# EAGLE design Codeshelf-0011.v01.r01 (EAGLE 5.11)
MFGN: Murata; MFGP: GRM155R71C104JA88D; PRICE: 0.03
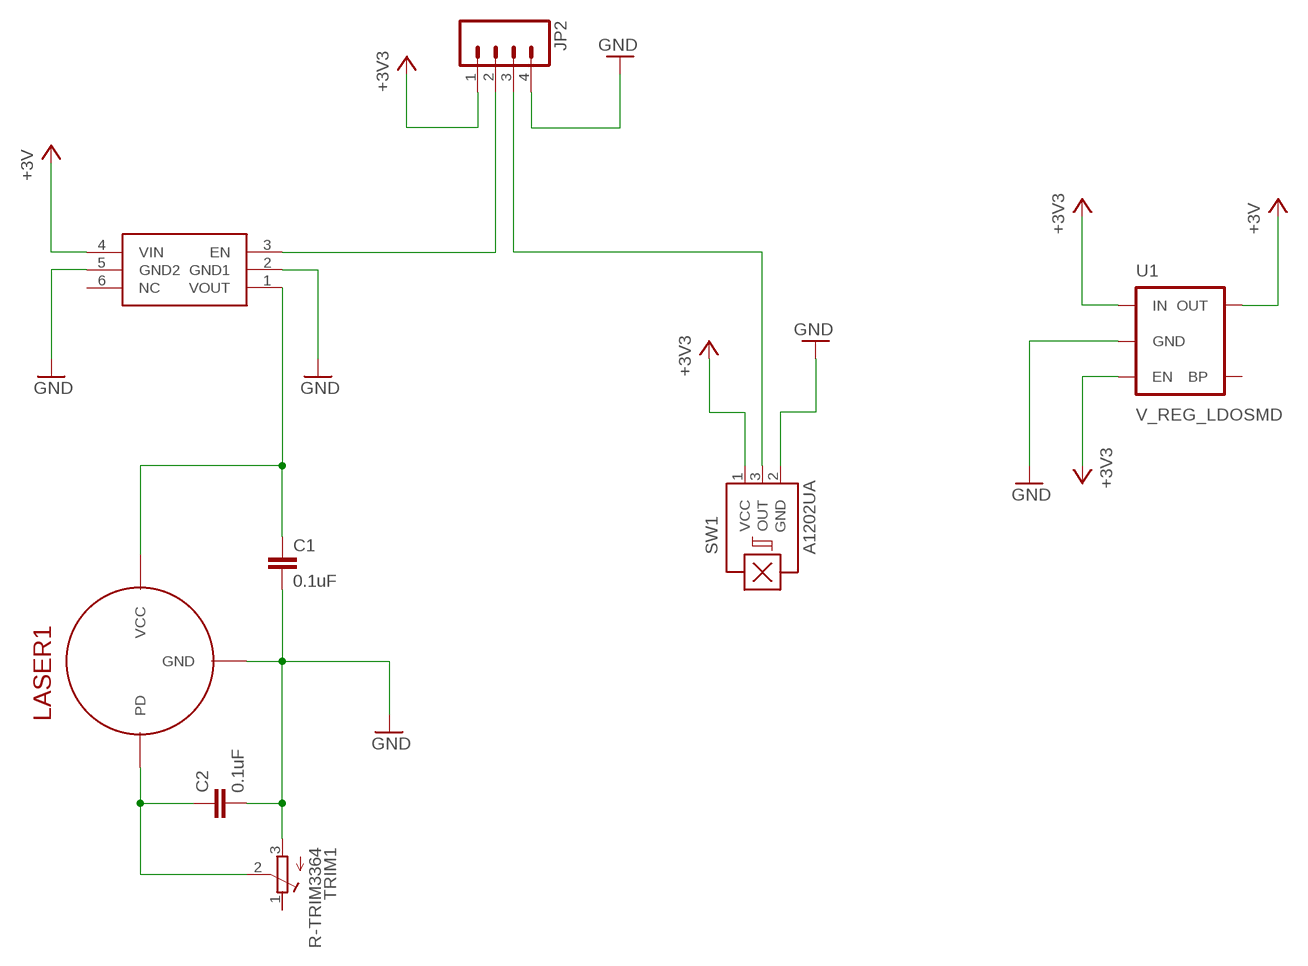
[diagram p0: schematic, sheet 1]

## Parts
C1  0.1uF  RF-C0402  [C0402]
C2  0.1uF  RF-C0402  [C0402]
JP2  M04PTH  [1X04]
LASER1  LMAPCD-650-06  [LMAPCD-650-06]
SW1  A1202UA  [SIP3-UA]
TRIM1  R-TRIM3364  [RTRIM3364]
U1  V_REG_LDOSMD  [SOT23-5]
U2  MIC94061C6  [SC70-6L]

## Nets
+3V [LASER]: U1.5(OUT) U2.4(VIN)
+3V3 [3v3]: JP2.1 SW1.1(VCC) U1.1(IN) U1.3(EN)
GND [GND]: C1.2 C2.2 JP2.4 LASER1.2(GND) SW1.2(GND) TRIM1.3(E) U1.2(GND) U2.2(GND1) U2.5(GND2)
N$1 [LASER]: C1.1 LASER1.1(VCC) U2.1(VOUT)
N$2: JP2.2 U2.3(EN)
N$3: JP2.3 SW1.3(OUT)
N$4: C2.1 LASER1.3(PD) TRIM1.2(S)
Unconnected: TRIM1.1(A) U1.4(BP) U2.6(NC)

## Library data of the parts
C1 C2 = GW-devices:RF-C: RF capacitor pads for FSL reference design
JP2 = SparkFun:M04: Header 4 Standard 4-pin 0.1" header. Use with straight break away headers (SKU : PRT-00116), right angle break away headers (PRT-00553), swiss pins (PRT-00743), machine pins (PRT-00117), and female headers (PRT-00115). Molex polarized connector foot print use with SKU : PRT-08231 with associated crimp pins and housings.
LASER1 = GW-devices:LMAPCD-650-06
SW1 = allegro:A12*?: Hall-effect bipolar switch Source: http://www.allegromicro.com/en/Products/Part_Numbers/1202/1202.pdf; OC_FARNELL: unknown; OC_NEWARK: unknown
TRIM1 = GW-devices:R-TRIM
U1 = SparkFun:V_REG_LDO: Voltage Regulator LDO Standard 150mA LDO voltage regulator in SOT-23 layout. Micrel part MIC5205. BP (by-pass) pin is used to lower output noise with 470pF cap.
U2 = GW-devices:MIC94061; MFGN: Micrel; MFGP: MIC94061YC6 TR; PRICE: 1.50

## Net classes
1 3v3: width 0.5 mm
2 12V: width 1 mm
3 LASER: width 0.5 mm
4 GND: width 0.5 mm
5 RS485: width 0.4 mm

## Board
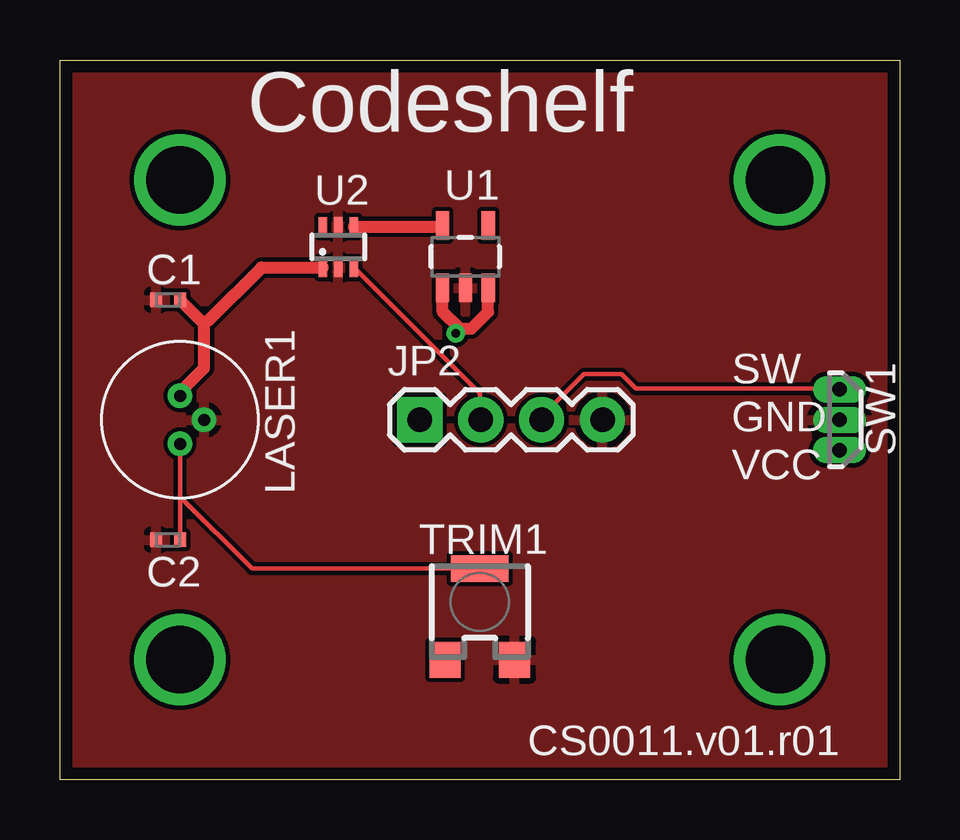
[diagram p1: board, top side]
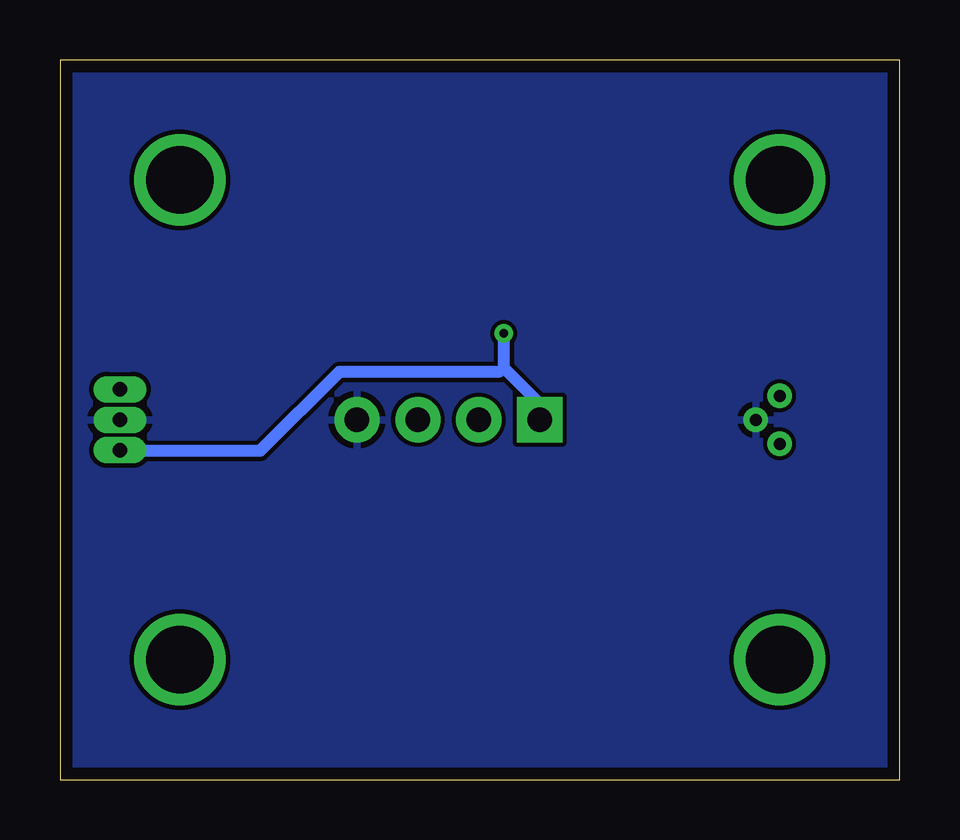
[diagram p2: board, bottom side, seen from below]

Size 35 x 30 mm. Coordinates in mm from the lower left corner, seen from the top.
Outline: 0,0 0,30 35,30 35,0 0,0
Copper layers (1*16): Top 0.0356mm / dielectric 1.5011mm / Bottom 0.0356mm
Design rules "SilverCircuits": minimum track width 7mil, minimum drill 14mil, track to track 7mil, track to pad 7mil, pad to pad 7mil, via to via 7mil, smd to smd 0mil, copper to edge 20mil, drill to drill 8mil, minimum pad ring 10mil, minimum via ring 8mil, stop-mask expansion 4mil, vias tented up to drill 0mil, thermal gap 10mil

### Footprints (pad centres in the part's own frame; a part is rotated, then mirrored left to right if it is on the bottom)
C0402 = smd 0.5 x 0.6: 1 -0.5,0; 2 0.5,0
1X04 = drill 1.016 pad 1.88 square: 1 0,0 | drill 1.016 pad 1.88: 2 2.54,0; 3 5.08,0; 4 7.62,0
LMAPCD-650-06 = drill 0.5: 1 -1,0; 2 0,1; 3 1,0
SIP3-UA = drill 0.6 pad 0.7 long: 1 -1.27,0; 2 0,0; 3 1.27,0
RTRIM3364 = smd 1.3 x 1.5: 1 -1.45,-2; 3 1.45,-2 | smd 2.4 x 1.1: 2 0,1.8
SOT23-5 = smd 0.55 x 1.2: 1 -0.95,-1.3; 2 0,-1.3; 3 0.95,-1.3; 4 0.95,1.3; 5 -0.95,1.3
SC70-6L = smd 0.35 x 0.8: 1 -0.65,-0.85; 2 0,-0.85; 3 0.65,-0.85; 4 0.65,0.85; 5 0,0.85; 6 -0.65,0.85

### Placement (x,y rotation side)
C1  4.5,20 180 top
C2  4.5,10 180 top
JP2  15,15 0 top
LASER1  5,15 270 top
SW1  32.5,15 90 top
TRIM1  17.5,7 0 top
U1  16.9,21.8 0 top
U2  11.6,22.2 0 top

### Tracks (layer width: path | path; a pad name or v marks a point on that pad's centre or on a via)
+3V
  Top 0.5: U2.4 15.9,23.05 U1.5 | U1.5
+3V3  (via drill 0.36)
  Top 0.5: 16.65,18.8 15.95,19.5 U1.1 | 16.65,18.8 17.15,18.8 17.85,19.5 U1.3 | v16.5,18.6 16.65,18.8
  Bottom 0.5: 16.5,17.15 v16.5,18.6 | 16.5,17.15 15,15.65 JP2.1 | SW1.1 32.5,13.7 26.65,13.7 23.35,17 16.7,17 16.5,17.15
GND
  pour Bottom: 0,0 0,30 35,30 35,0
  pour Top: 0,0 0,30 35,30 35,0
N$1
  Top 0.5: 6,19 C1.1 | 6,19 6,17.15 5,16.15 LASER1.1 | U2.1 8.4,21.35 6.2,19.15 6,19
N$2
  Top 0.178: U2.3 17.5,16.1 17.5,15 JP2.2
N$3
  Top 0.178: SW1.3 32.5,16.3 24,16.3 23.4,16.9 21.85,16.9 20.1,15.15 20.1,15 JP2.3
N$4
  Top 0.178: 5,11.75 LASER1.3 | C2.1 5,11.75 | TRIM1.2 8,8.8 5.05,11.75 5,11.75
N$5  (via drill 2.8)
  other vias: 5,5
N$9  (via drill 2.8)
  other vias: 30,5
N$21  (via drill 2.8)
  other vias: 5,25
N$27  (via drill 2.8)
  other vias: 30,25

### Text on the board
tPlace: Codeshelf | SW | GND | VCC | CS0011.v01.r01